# Altium project Smart_Home_v1.PrjPcb
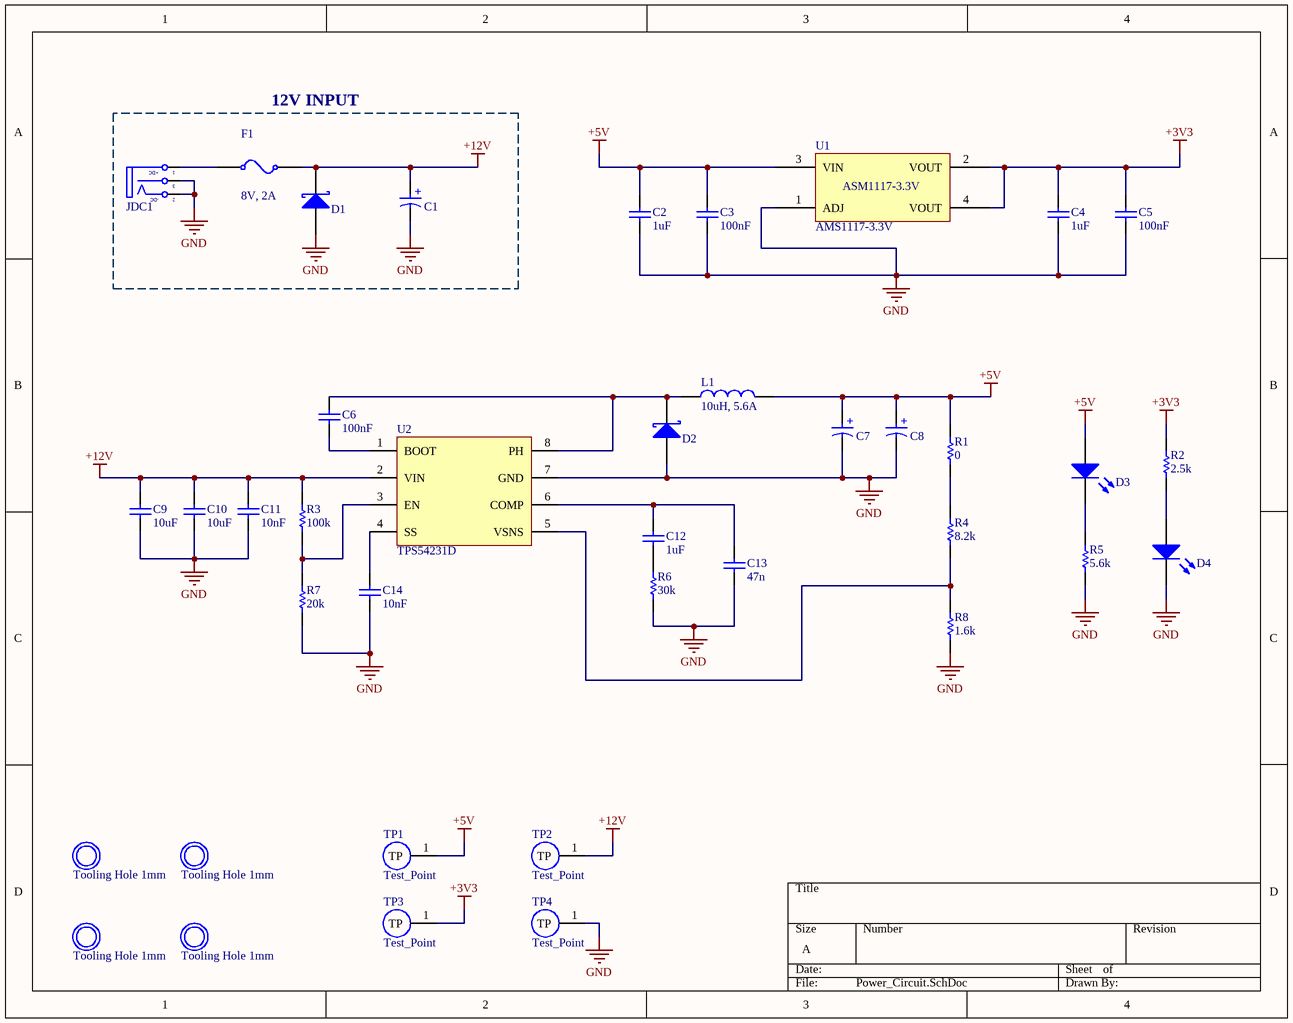
[diagram p0: Power_Circuit.SchDoc]
5 sheets, 133 parts. Net scope: flat (ports and power ports of the same name join across sheets).
Board file: PCB1.PcbDoc
Sheets:
  Power_Circuit.SchDoc
  STM.SchDoc
  ESP.SchDoc
  Output.SchDoc
  Sheet1.SchDoc

## Sheet Power_Circuit.SchDoc
size A; SheetNumber: 1; SheetTotal: 5

### Parts
C1  47uF  [WCAP-ASLI_D4H5.5]  (value not drawn)
C2  1uF  [CAP_0603]
C3  100nF  [CAP_0603]
C4  1uF  [CAP_0603]
C5  100nF  [CAP_0603]
C6  100nF  [CAP_0603]
C7  47uF  [WCAP-ASLI_D5H5.5]  (value not drawn)
C8  47uF  [WCAP-ASLI_D5H5.5]  (value not drawn)
C9  10uF  [CAP_0603]
C10  10uF  [CAP_0603]
C11  10nF  [CAP_0603]
C12  1uF  [CAP_0603]
C13  47n  [CAP_0603]
C14  10nF  [CAP_0603]
D1  D Schottky  [SS34]  (value not drawn)
D2  D Schottky  [SS34]  (value not drawn)
D3  LED SMD  [LED_0805_Blue]  (value not drawn)
D4  LED SMD  [LED_0805_Blue]  (value not drawn)
F1  8V, 2A  [Fuse_SMD_1812]
H1  Tooling Hole 1mm  [2mm]
H2  Tooling Hole 1mm  [2mm]
H3  Tooling Hole 1mm  [2mm]
H4  Tooling Hole 1mm  [2mm]
JDC1  Jack DC  [DC-IN]  (value not drawn)
L1  10uH, 5.6A  [WE-PD2A_5848]
R1  0  [resistor_0603]
R2  2.5k  [resistor_0603]
R3  100k  [resistor_0603]
R4  8.2k  [resistor_0603]
R5  5.6k  [resistor_0603]
R6  30k  [resistor_0603]
R7  20k  [resistor_0603]
R8  1.6k  [resistor_0603]
TP1  Test_Point  [TP_2MM]
TP2  Test_Point  [TP_2MM]
TP3  Test_Point  [TP_2MM]
TP4  Test_Point  [TP_2MM]
U1  AMS1117-3.3V  [AMS1117-3.3V SOT223]
U2  TPS54231D  [SOIC8]

### Blocks framed on the sheet
12V INPUT: C1 D1 F1 JDC1

### Nets
+3V3: C4.2 C5.2 R2.2 TP3.1(TP) U1.2(VOUT) U1.4(VOUT)
+5V: C2.2 C3.2 C7.1(P) C8.1(P) D3.1(A) L1.2 R1.2 TP1.1(TP) U1.3(VIN)
+12V: C1.1(P) C9.2 C10.2 C11.2 D1.2(K) F1.1 R3.2 TP2.1(TP) U2.2(VIN)
GND: C1.2(N) C2.1 C3.1 C4.1 C5.1 C7.2(N) C8.2(N) C9.1 C10.1 C11.1 C13.1 C14.1 D1.1(A) D2.1(A) D4.2(K) JDC1.2(TN) JDC1.3(S) R5.1 R6.1 R7.1 R8.1 TP4.1(TP) U1.1(ADJ) U2.7(GND)
NetC6_1: C6.1 U2.1(BOOT)
NetC6_2: C6.2 D2.2(K) L1.1 U2.8(PH)
NetC12_1: C12.1 C13.2 U2.6(COMP)
NetC12_2: C12.2 R6.2
NetC14_2: C14.2 U2.4(SS)
NetD3_2: D3.2(K) R5.2
NetD4_1: D4.1(A) R2.1
NetF1_0: F1.0 JDC1.1(T)
NetR1_1: R1.1 R4.2
NetR3_1: R3.1 R7.2 U2.3(EN)
NetR4_1: R4.1 R8.2 U2.5(VSNS)

### Notes on the sheet
- (in symbol 865080340003) +
- (in symbol 865080342006) +
- (in symbol AMS1117-3.3V) ASM1117-3.3V
- (in symbol Jack DC) +DC; -DC

### Library data of the parts
C1 = 865080340003: V-Chip, D4 x H5.5mm, 22uF, 16V; Capacitance Tolerance: +/-20%; Dissipation Factor: 16%; Endurance: 2000h; Leakage Current: 3.52uA; Ripple Current: 90mA; Supply 1 Name: Mouser; Supply 1 SN: 710-865080340003; Supply 2 Name: thegioiic; Category: Aluminum Electrolytic Capacitors; ComponentLink2Description: Datasheet Link; ComponentLink2URL: https://www.we-online.com/redexpert/spec/865080340003?ad; Mount: Surface Mount; Operating Temperature Max: 105°C; Operating Temperature Min: -55°C; Packaging: Tape and Reel; Height: 5.5mm; Diameter: 4mm; Capacitance: 22uF; Rated Voltage (DC): 16V; Supply 1 URL: https://www.mouser.com/ProductDetail/Wurth-Elektronik/865080340003?qs=0KOYDY2FL2%252BowmC4S50IuQ%3D%3D; Supply 2 URL: https://www.thegioiic.com/tu-nhom-smd-22uf-16v-4x5-4mm
C2 C4 C12 = 01060310510: CAP, size 0603, 1uF; Supply 1 SN: 885012206126; Supply 1 name: Wurth Elektronik; Supply 2 name: Thegioiic; Capacitance Tolerance: +/-10%; ComponentLink1Description: Manufacturer; ComponentLink1URL: http://www.we-online.de; ComponentLink2Description: Datasheet; ComponentLink2URL: https://www.we-online.com/components/products/datasheet/885012206126.pdf; Operating Temperature: -55 to +125degC; Packaging: Tape and Reel; Supply 1 URL: https://www.we-online.com/en/components/products/WCAP-CSGP-50VDC?sq=885012206126#885012206126; Supply 2 SN: *; Supply 2 URL: https://www.thegioiic.com/tu-gom-0603-1uf-50v; Dissipation Factor: *; Height: *; Mounting Technology: SMT; Size: 0603; Capacitance: 1uF; Technical Reference: *
C3 C5 C6 = 01060310410: CAP, size 0603, 100nF; Supply 1 SN: 885012206095; Supply 1 name: Wurth Elektronik; Supply 2 name: Thegioiic; Capacitance Tolerance: +/-10%; ComponentLink1Description: Manufacturer; ComponentLink1URL: http://www.we-online.de; ComponentLink2Description: Datasheet; ComponentLink2URL: https://www.we-online.com/catalog/datasheet/885012206095.pdf; Operating Temperature: -55 to +125degC; Packaging: Tape and Reel; Supply 1 URL: https://www.we-online.com/en/components/products/WCAP-CSGP-50VDC?sq=885012206095R#885012206095R; Supply 2 SN: *; Supply 2 URL: https://www.thegioiic.com/tu-gom-0603-100nf-0-1uf-50v; Dissipation Factor: *; Height: *; Mounting Technology: SMT; Size: 0603; Capacitance: 100nF; Technical Reference: *
C7 C8 = 865080342006: V-Chip, D5 x H5.5mm, 47uF, 16V; Capacitance Tolerance: +/-20%; Dissipation Factor: 16%; Endurance: 2000h; Leakage Current: 7.52uA; Ripple Current: 195mA; Supply 1 Name: Mouser; Supply 1 SN: 710-865080262015; Supply 2 Name: thegioiic; Category: Aluminum Electrolytic Capacitors; ComponentLink2Description: Datasheet Link; ComponentLink2URL: https://www.we-online.com/redexpert/spec/865080342006?ad; Mount: Surface Mount; Operating Temperature Max: 105°C; Operating Temperature Min: -55°C; Packaging: Tape and Reel; Height: 5.5mm; Diameter: 5mm; Capacitance: 47uF; Rated Voltage (DC): 16V; Supply 1 URL: https://www.mouser.com/ProductDetail/Wurth-Elektronik/865080262015?qs=0KOYDY2FL2%2Ffe5w2MssUoQ%3D%3D; Supply 2 URL: https://www.thegioiic.com/tu-nhom-smd-47uf-16v-5x5-4mm
C9 C10 = 01060310010: CAP, size 0603,10uF; Supply 2 name: Thegioiic; Capacitance Tolerance: +/-10%; ComponentLink1Description: Manufacturer; ComponentLink1URL: *; ComponentLink2Description: Datasheet; ComponentLink2URL: *; Operating Temperature: -55 to +125degC; Packaging: Tape and Reel; Supply 1 SN: *; Supply 1 name: *; Supply 1 URL: *; Supply 2 SN: *; Supply 2 URL: https://www.thegioiic.com/tu-gom-0603-10uf-16v; Dissipation Factor: *; Height: *; Mounting Technology: SMT; Size: 0603; Capacitance: 10uF; Technical Reference: *
C11 C14 = 01060310310: CAP, size 0603, 10nF; Supply 1 SN: 885012206089; Supply 1 name: Wurth Elektronik; Supply 2 name: Thegioiic; Capacitance Tolerance: +/-10%; ComponentLink1Description: Manufacturer; ComponentLink1URL: http://www.we-online.de; ComponentLink2Description: Datasheet; ComponentLink2URL: https://www.we-online.com/catalog/datasheet/885012206089.pdf; Operating Temperature: -55 to +125degC; Packaging: Tape and Reel; Supply 1 URL: https://www.we-online.com/en/components/products/WCAP-CSGP-50VDC?sq=885012206089#885012206089; Supply 2 SN: *; Supply 2 URL: https://www.thegioiic.com/tu-gom-0603-10nf-50v; Dissipation Factor: *; Height: *; Mounting Technology: SMT; Size: 0603; Capacitance: 10nF; Technical Reference: *
C13 = 01060347310: CAP, size 0603, 47nF; Supply 1 SN: 885012206093; Supply 1 name: Wurth Elektronik; Supply 2 name: Thegioiic; Capacitance Tolerance: +/-10%; ComponentLink1Description: Manufacturer; ComponentLink1URL: http://www.we-online.de; ComponentLink2Description: Datasheet; ComponentLink2URL: https://www.we-online.com/catalog/datasheet/885012206093.pdf; Operating Temperature: -55 to +125degC; Packaging: Tape and Reel; Supply 1 URL: https://www.we-online.com/en/components/products/WCAP-CSGP-50VDC?sq=885012206093#885012206093; Supply 2 SN: *; Supply 2 URL: https://www.thegioiic.com/tu-gom-0603-47nf-50v; Dissipation Factor: *; Height: *; Mounting Technology: SMT; Size: 0603; Capacitance: 47nF; Technical Reference: *
D1 D2 = D Schottky: Schottky Diode; Published: 8-Jun-2000; LatestRevisionDate: 17-Jul-2002; LatestRevisionNote: Re-released for DXP Platform.; PackageReference: SMB; Publisher: Altium Limited; PackageDescription: DO-214-AA/SMB; 2 C-Bend Leads; Body 5.3 x 3.6 mm, inc. leads (LxW); Code_JEDEC: DO-214-AA
D3 D4 = LED SMD: LED
F1 = 061812200008: Resettable Fuse, Size 1812, 8V, 2A; Manufacturer: Littelfuse; Threshold Current: 100A; Trip Current: 4A; Supply 1 Name: Mouser; Supply 1 SN: 650-MINISMDC200F-2; Supply 2 Name: Digikey; Supply 2 SN: MINISMDC200F-2TR-ND; Supply 3 Name: Thegioiic; Threshold Voltage: 8V; Hold Current: 2A; Size: 1812; Mounting Technology: SMT/SMD; ComponentLink1Description: Datasheet link; ComponentLink1URL: https://www.littelfuse.com/~/media/electronics/product_specifications/resettable_ptcs/littelfuse_ptc_minismdc300f_2_product_specification.pdf.pdf; ComponentLink2Description: Supply 1 URL; ComponentLink2URL: https://www.mouser.vn/ProductDetail/Littelfuse/MINISMDC200F-2?qs=F6FIpiMdEVbPu4q%2F42CC1w%3D%3D; ComponentLink3Description: Supply 2 URL; ComponentLink3URL: https://www.digikey.com/en/products/detail/littelfuse-inc/MINISMDC200F-2/1045898?s=N4IgTCBcDaIAQFkCSA5JBlBARAwmADPgGIC0EAugL5A; ComponentLink4Description: Supply 3 URL; ComponentLink4URL: https://www.thegioiic.com/cau-chi-tu-phuc-hoi-1812-8v-2a; Supply 3 SN: N/A
H1-H4 = Tooling Hole 2mm
JDC1 = Jack DC: Jack DC input; Value: Jac DC
L1 = 78477410: WE-PD2A SMT Power Inductor, size 5848, 10uH, 2.2A; Manufacturer: Wurth Elektronik; DC Resistance max.: 0.1Ohm; Saturation Current: 2.5A; Self Resonant Frequency: 26MHz; DC Resistance typ.: 0.078Ohm; Rated Voltage: 80VDC; Supply 1 Name: Digi-Key; Supply 1 SN: 732-6830-2-ND; Supply 2 Name: Mouser; Supply 2 SN: 710-78477410; Supply 3 Name: thegioiic; ComponentLink1Description: Manufacturer; ComponentLink1URL: http://www.we-online.de; ComponentLink2Description: Datasheet; ComponentLink2URL: https://www.we-online.com/catalog/datasheet/78477410.pdf; Manufacturer Part Number: 78477410; Published Date: May 2020; Rated Current: 2.2A; Inductance: 10uH; Operating Temperature: -40 to +125degC; Mounting Technology: SMT; Packaging: Tape and Reel; Size: 5848; Supply 1 URL: https://www.digikey.com/en/products/detail/w%C3%BCrth-elektronik/78477410/5168779?s=N4IgTCBcDaIOwA4Asc5IIwAYQF0C%2BQA; Supply 2 URL: https://www.mouser.vn/ProductDetail/Wurth-Elektronik/78477410?qs=sBf%2Fb4nBSldlX6CYaJExDg%3D%3D; Supply 3 URL: https://www.thegioiic.com/cuon-cam-dan-smd-cd53-5852-100-10uh-1-8a
R1 = 0006030001: RES, 0 Ohm, size 0603, 1%; Resistance tolerance: +/-5%; Rated Power: 1/4 W; Resistance: 2.5K; Size: 0603; Mounting Technology: SMT; Datasheet: *; ComponentLink1Description: Datasheet link; ComponentLink1URL: *; Supply 1 Name: *; Supply 1 SN: *; Supply 1 URL: *; Supply 2 Name: *; Supply 2 SN: *; Supply 2 URL: *; Supply 3 Name: *; Supply 3 SN: *; Supply 3 URL: *; Manufacture  Name: *; Manufacture  SN: *
R2 = 0006032525: RES, 2.5K Ohm, size 0603, 5%; Resistance tolerance: +/-5%; Rated Power: 1/4 W; Size: 0603; Mounting Technology: SMT; Datasheet: *; Resistance: 2.5K; ComponentLink1Description: Datasheet link; ComponentLink1URL: *; Supply 1 Name: *; Supply 1 SN: *; Supply 1 URL: *; Supply 2 Name: *; Supply 2 SN: *; Supply 2 URL: *; Supply 3 Name: *; Supply 3 SN: *; Supply 3 URL: *; Manufacture  Name: *; Manufacture  SN: *
R3 = 0006031041: RES, 100k Ohm, size 0603, 1%; Resistance Tolerant: +/-1%; Rated Power: 1/4W; Supply 1 Name: Mouser; Supply 1 SN: 603-SR0603FR-7T100KL; Supply 2 Name: Digikey; Supply 2 SN: YAG5821TR-ND YAG5821CT-ND YAG5821DKR-ND; Resistance: 100k; Size: 0603; Mounting Technology: SMT; ComponentLink1Description: Datasheet link; ComponentLink1URL: https://www.yageo.com/upload/media/product/productsearch/datasheet/rchip/PYu-SR_20105_RoHS_L_10.pdf; ComponentLink2Description: Supply 1 URL; ComponentLink2URL: https://www.mouser.vn/ProductDetail/YAGEO/SR0603FR-7T100KL?qs=sGAEpiMZZMvdGkrng054tz1y1XEHv7sNa%252BA%2F4WiDMf7aGw4zRBb%2FFQ%3D%3D; ComponentLink3Description: Supply 2 URL; ComponentLink3URL: https://www.digikey.com/en/products/detail/yageo/SR0603FR-7T100KL/9373095
R4 = 0006038251: RES, 8.2 kOhms, size 0603, 1%; Resistance tolerance: +/-1%; Rated Power: 1/4 W; Supply 1 Name: Mouser; Supply 1 SN: 660-HV731JTTD8204F; Supply 2 Name: Digi-Key; Supply 2 SN: 13-RC0603FR-078M2LTR-ND; Size: 0603; Mounting Technology: SMT; Resistance: 8.2K; ComponentLink1Description: Datasheet link; ComponentLink1URL: *; Supply 1 URL: https://www.mouser.vn/ProductDetail/KOA-Speer/HV731JTTD8204F?qs=ZqVPfSd1khqN0teaqWW7DA%3D%3D; Supply 2 URL: https://www.digikey.com/en/products/detail/yageo/RC0603FR-078M2L/5918418; Supply 3 Name: *; Supply 3 SN: *
R5 = 0006035621: RES, 5.6k Ohm, size 0603, 1%; Resistance Tolerant: +/-1%; Rated Power: 1/4W; Supply 1 Name: Mouser; Supply 1 SN: 667-ERJ-UP3F5601V; Supply 2 Name: Digikey; Supply 2 SN: 10-ERJ-UP3F5601VTR-ND 10-ERJ-UP3F5601VCT-ND 10-ERJ-UP3F5601VDKR-ND; Resistance: 5.6k; Size: 0603; Mounting Technology: SMT; ComponentLink1Description: Datasheet link; ComponentLink1URL: https://api.pim.na.industrial.panasonic.com/file_stream/main/fileversion/4484; ComponentLink2Description: Supply 1 URL; ComponentLink2URL: https://www.mouser.vn/ProductDetail/Panasonic/ERJ-UP3F5601V?qs=sGAEpiMZZMvdGkrng054twq3eZrCFN89ezYxgAsnxBTZYD17cS%252B65A%3D%3D; ComponentLink3Description: Supply 2 URL; ComponentLink3URL: https://www.digikey.com/en/products/detail/panasonic-electronic-components/ERJ-UP3F5601V/12092890
R6 = 0006033205: RES, 30k Ohm, size 0603, 1%; Resistance tolerance: +/-1%; Rated Power: 1/4 W; Size: 0603; Mounting Technology: SMT; Datasheet: *; Resistance: 30k; ComponentLink1Description: Datasheet link; ComponentLink1URL: *; Supply 1 Name: *; Supply 1 SN: *; Supply 1 URL: *; Supply 2 Name: *; Supply 2 SN: *; Supply 2 URL: *; Supply 3 Name: *; Supply 3 SN: *; Supply 3 URL: *; Manufacture  Name: *; Manufacture  SN: *
R7 = 0006032031: RES, 20 kOhms, size 0603, 1%; Resistance tolerance: +/-1%; Rated Power: 1/4 W; Supply 1 Name: Mouser; Supply 1 SN: 667-ERJ-S03F2002V; Supply 2 Name: Digi-Key; Supply 2 SN: 13-RC0603FR-1320KLTR-ND; Size: 0603; Mounting Technology: SMT; Resistance: 20 k; ComponentLink1Description: Datasheet link; ComponentLink1URL: *; Supply 1 URL: https://www.mouser.vn/ProductDetail/Panasonic/ERJ-S03F2002V?qs=Zyl8A9hlmJopfTdqNIDujw%3D%3D; Supply 2 URL: https://www.digikey.com/en/products/detail/yageo/RC0603FR-1320KL/13694225; Supply 3 Name: *; Supply 3 SN: *
R8 = 0006031521: RES, 1.5 kOhms, size 0603, 1%; Resistance tolerance: +/-1%; Rated Power: 1/4 W; Resistance: 1.5 k; Supply 1 Name: Mouser; Supply 1 SN: 755-SFR03EZPF1501; Supply 2 Name: Digi-Key; Supply 2 SN: 13-RC0603FR-071R5LTR-ND; Size: 0603; Mounting Technology: SMT; ComponentLink1Description: Datasheet link; ComponentLink1URL: *; Supply 1 URL: https://www.mouser.vn/ProductDetail/ROHM-Semiconductor/SFR03EZPF1501?qs=byeeYqUIh0NryWvnzlukLQ%3D%3D; Supply 2 URL: https://www.digikey.com/en/products/detail/yageo/RC0603FR-071R5L/5918292; Supply 3 Name: *; Supply 3 SN: *
TP1-TP4 = Test_Point: Test point, 2mm radius
U1 = AMS1117-3.3V: AMS1117-3.3V, OUT 3.3V 1A.; Manufacturer: AMS; Pad Count: 4; Current Output Maximum: 1A; Voltage Input Maximum: 15V; Manufacturer Part Number: *; Part Number: *; Current Input Maximum: *; Supplier 1 Link: *; Supplier 1 Name: *; Supplier 2 Link: *; Supplier 2 Name: *; Supplier 2 Part Number: *; Supplier 3 Link: https://www.thegioiic.com/ams1117-3-3v-ic-on-ap-3-3v-1a-sot-223; Supplier 3 Name: ThegioiIC; Supplier 3 Part Number: *; Voltage Output: 3.3V; Mounting Technology: SMD; Supplier 1 Part Number: *; Datasheet: http://www.advanced-monolithic.com/pdf/ds1117.pdf
U2 = TPS54231: Buck Switching Regulator IC Positive Adjustable 0.8V 1 Output 2A 8-SOIC (0.154", 3.90mm Width); Mfr: Texas Instruments; Function: Step-Down; Number of Outputs: 1; Voltage - Input (Min): 3.5V; Voltage - Input (Max): 28V; Voltage - Output (Max): 25V; Frequency - Switching: 570kHz; Category: Integrated Circuits (ICs); Output Configuration: Positive; Topology: Buck; Output Type: Adjustable; Voltage - Output (Min/Fixed): 0.8V; Current - Output: 2A; Operating Temperature: -40°C ~ 150°C (TJ); Mounting Type: Surface Mount; ComponentLink1Description: Thegioiic; ComponentLink1URL: https://www.thegioiic.com/tps54231dr-ic-dieu-chinh-giam-ap-2a-8-soic; ComponentLink2Description: Datasheet; ComponentLink2URL: https://www.ti.com/lit/ds/symlink/tps54231.pdf

## Sheet STM.SchDoc
size A; SheetNumber: 2; SheetTotal: 5
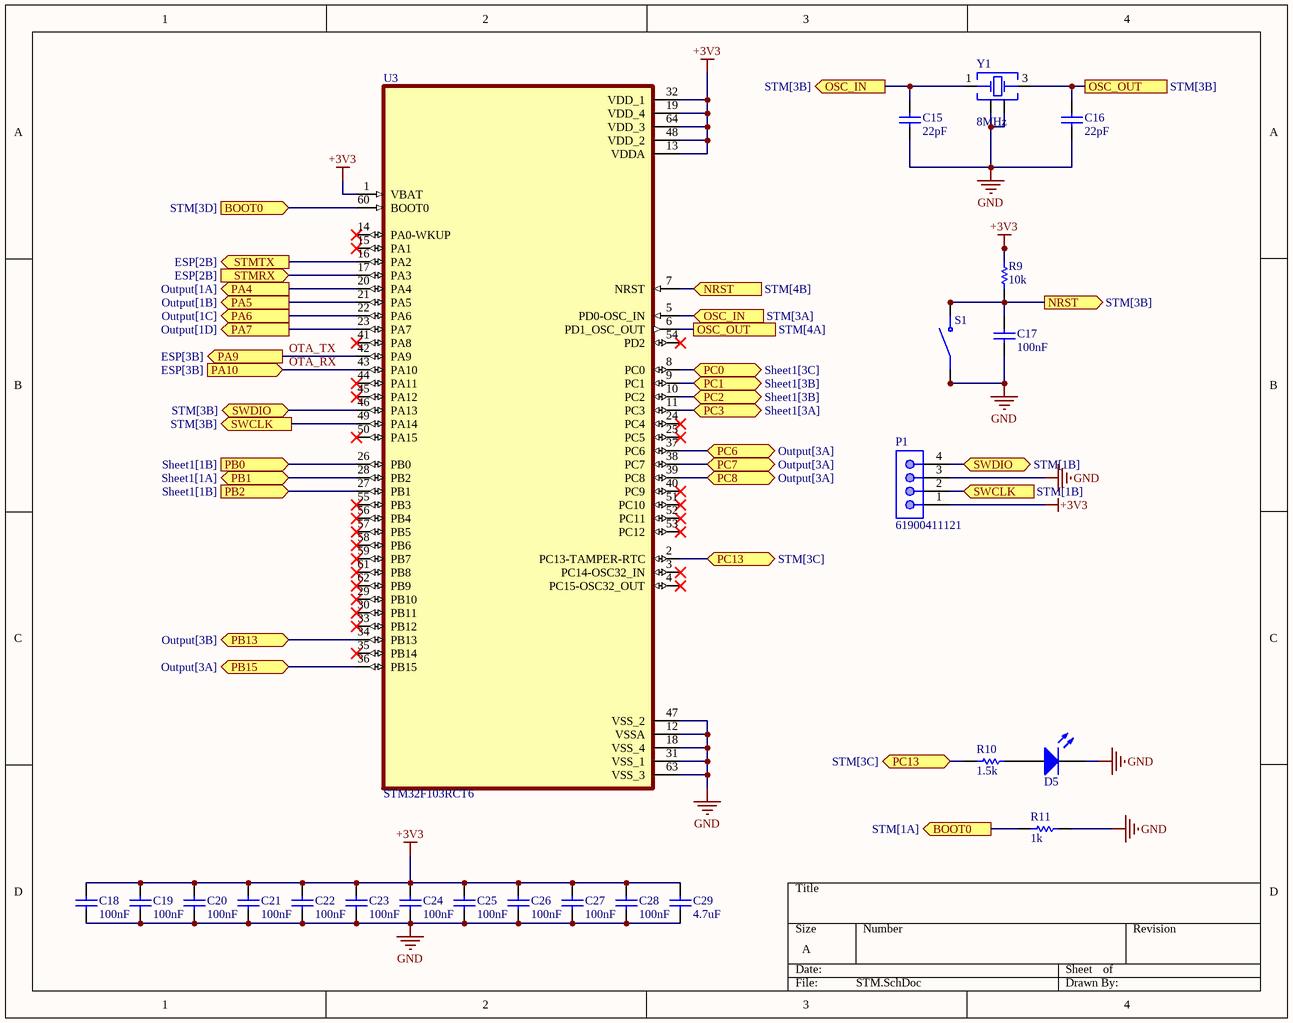
[diagram p1: STM.SchDoc]

### Parts
C15  22pF  [CAP_0603]
C16  22pF  [CAP_0603]
C17  100nF  [CAP_0603]
C18  100nF  [CAP_0603]
C19  100nF  [CAP_0603]
C20  100nF  [CAP_0603]
C21  100nF  [CAP_0603]
C22  100nF  [CAP_0603]
C23  100nF  [CAP_0603]
C24  100nF  [CAP_0603]
C25  100nF  [CAP_0603]
C26  100nF  [CAP_0603]
C27  100nF  [CAP_0603]
C28  100nF  [CAP_0603]
C29  4.7uF  [CAP_0603]
D5  LED SMD  [LED_0805_Blue]  (value not drawn)
P1  61900411121  [61900411121]
R9  10k  [resistor_0603]
R10  1.5k  [resistor_0603]
R11  1k  [resistor_0603]
S1  (no value)  [SW_8-1437565-1]
U3  STM32F103RCT6  [QFP50P1200X1200X160-64N]
Y1  8MHz  [WE-XTAL_CFPX-104]

### Ports
BOOT0 (in, see STM[3D]), BOOT0 (out, see STM[1A]), NRST (in, see STM[4B]), NRST (out, see STM[3B]), OSC_IN (in, see STM[3A]), OSC_IN (out, see STM[3B]), OSC_OUT (see STM[3B]), OSC_OUT (see STM[4A]), PA4 (out, see Output[1A]), PA5 (out, see Output[1B]), PA6 (out, see Output[1C]), PA7 (out, see Output[1D]), PA9 (out, see ESP[3B]), PA10 (in, see ESP[3B]), PB0 (in, see Sheet1[1B]), PB1 (bidir, see Sheet1[1A]), PB2 (in, see Sheet1[1B]), PB13 (bidir, see Output[3B]), PB15 (bidir, see Output[3A]), PC0 (bidir, see Sheet1[3C]), PC1 (bidir, see Sheet1[3B]), PC2 (bidir, see Sheet1[3B]), PC3 (bidir, see Sheet1[3A]), PC6 (bidir, see Output[3A]), PC7 (bidir, see Output[3A]), PC8 (bidir, see Output[3A]), PC13 (bidir, see STM[3C]), STMRX (in, see ESP[2B]), STMTX (out, see ESP[2B]), SWCLK (in, see STM[1B]), SWCLK (out, see STM[3B]), SWDIO (bidir, see STM[1B]), SWDIO (bidir, see STM[3B])

### Nets
+3V3: C18.2 C19.2 C20.2 C21.2 C22.2 C23.1 C24.2 C25.2 C26.2 C27.2 C28.2 C29.2 P1.1 R9.2 U3.1(VBAT) U3.13(VDDA) U3.19(VDD_4) U3.32(VDD_1) U3.48(VDD_2) U3.64(VDD_3)
GND: C15.1 C16.1 C17.1 C18.1 C19.1 C20.1 C21.1 C22.1 C23.2 C24.1 C25.1 C26.1 C27.1 C28.1 C29.1 D5.2(K) P1.3 R11.2 S1.1(COM) S1.2(COM) U3.12(VSSA) U3.18(VSS_4) U3.31(VSS_1) U3.47(VSS_2) U3.63(VSS_3) Y1.2(GND) Y1.4(GND)
OTA_RX: U3.43(PA10) ; port PA10
OTA_TX: U3.42(PA9) ; port PA9
NetC15_2: C15.2 U3.5(PD0-OSC_IN) Y1.1(OSC1) ; port OSC_IN
NetC16_2: C16.2 U3.6(PD1_OSC_OUT) Y1.3(OSC2) ; port OSC_OUT
NetC17_2: C17.2 R9.1 S1.3(NO) S1.4(NO) U3.7(NRST) ; port NRST
NetC39_1: U3.11(PC3) ; port PC3
NetC40_1: U3.10(PC2) ; port PC2
NetC41_1: U3.9(PC1) ; port PC1
NetC42_1: U3.8(PC0) ; port PC0
NetD5_1: D5.1(A) R10.1
NetJ2_3: U3.39(PC8) ; port PC8
NetJ2_4: U3.38(PC7) ; port PC7
NetJ2_5: U3.37(PC6) ; port PC6
NetJ2_6: U3.36(PB15) ; port PB15
NetJ2_7: U3.34(PB13) ; port PB13
NetJ3_2: U3.28(PB2) ; port PB1
NetJ4_2: U3.27(PB1) ; port PB2
NetP1_2: P1.2 U3.49(PA14) ; port SWCLK
NetP1_4: P1.4 U3.46(PA13) ; port SWDIO
NetR10_2: R10.2 U3.2(PC13-TAMPER-RTC) ; port PC13
NetR11_1: R11.1 U3.60(BOOT0) ; port BOOT0
NetU3_16: U3.16(PA2) ; port STMTX
NetU3_17: U3.17(PA3) ; port STMRX
NetU3_20: U3.20(PA4) ; port PA4
NetU3_21: U3.21(PA5) ; port PA5
NetU3_22: U3.22(PA6) ; port PA6
NetU3_23: U3.23(PA7) ; port PA7
NetU3_26: U3.26(PB0) ; port PB0

Not connected (* = marked no-connect by the designer): U3 3(PC14-OSC32_IN)* 4(PC15-OSC32_OUT)* 14(PA0-WKUP)* 15(PA1)* 24(PC4)* 25(PC5)* 29(PB10)* 30(PB11)* 33(PB12)* 35(PB14)* 40(PC9)* 41(PA8)* 44(PA11)* 45(PA12)* 50(PA15)* 51(PC10)* 52(PC11)* 53(PC12)* 54(PD2)* 55(PB3)* 56(PB4)* 57(PB5)* 58(PB6)* 59(PB7)* 61(PB8)* 62(PB9)*

### Library data of the parts
C15 C16 = 01060322010: CAP, size 0603, 22pF; Supply 2 name: Thegioiic; Capacitance Tolerance: +/-10%; ComponentLink1Description: Manufacturer; ComponentLink1URL: Thegioiic; ComponentLink2Description: Datasheet; ComponentLink2URL: *; Operating Temperature: -55 to +125degC; Packaging: Tape and Reel; Supply 1 SN: *; Supply 1 name: *; Supply 1 URL: *; Supply 2 SN: *; Supply 2 URL: https://www.thegioiic.com/tu-gom-0603-22pf-50v; *: *; Height: *; Mounting Technology: SMT; Size: 0603; Capacitance: 22pF; Technical Reference: *
C17-C28 = 01060310410: as C3 on sheet Power_Circuit; ComponentLink1Description: Manufacturer; ComponentLink1URL: http://www.we-online.de; ComponentLink2Description: Datasheet; ComponentLink2URL: https://www.we-online.com/catalog/datasheet/885012206095.pdf; Operating Temperature: -55 to +125degC; Packaging: Tape and Reel; Supply 1 URL: https://www.we-online.com/en/components/products/WCAP-CSGP-50VDC?sq=885012206095R#885012206095R; Supply 2 SN: *; Supply 2 URL: https://www.thegioiic.com/tu-gom-0603-100nf-0-1uf-50v; Dissipation Factor: *; Height: *; Mounting Technology: SMT; Size: 0603; Capacitance: 100nF; Technical Reference: *
C29 = 01060310510: as C2 on sheet Power_Circuit; ComponentLink1Description: Manufacturer; ComponentLink1URL: http://www.we-online.de; ComponentLink2Description: Datasheet; ComponentLink2URL: https://www.we-online.com/components/products/datasheet/885012206126.pdf; Operating Temperature: -55 to +125degC; Packaging: Tape and Reel; Supply 1 URL: https://www.we-online.com/en/components/products/WCAP-CSGP-50VDC?sq=885012206126#885012206126; Supply 2 SN: *; Supply 2 URL: https://www.thegioiic.com/tu-gom-0603-1uf-50v; Dissipation Factor: *; Height: *; Mounting Technology: SMT; Size: 0603; Capacitance: 1uF; Technical Reference: *
D5 = LED SMD: LED
P1 = 61900411121: WR-WTB THT Male Vertical Locking Header, pitch 2.54mm, 4p; Pin Number: 4; Contact Resistance: 20mOhm; Rated Current: 3A; Withstanding Voltage: 1000VAC; Working Voltage: 250VAC; ComponentLink1Description: Manufacturer; ComponentLink1URL: http://www.we-online.de; ComponentLink2Description: Datasheet; ComponentLink2URL: https://www.we-online.com/catalog/datasheet/61900411121.pdf; Pitch: 2.54mm; Published Date: January 2020; Publisher: Wurth Elektronik; Mounting Technology: THT; Packaging: Bag; Operating Temperature: -40 to +105degC; Part Number: 61900411121; Gender: Male; Type: Vertical
R9 R11 = 0006031031: RES, 10k Ohm, size 0603, 1%; Resistance Tolerant: +/-1%; Rated Power: 1/4W; Supply 1 Name: Mouser; Supply 1 SN: 755-ESR03EZPF1002; Supply 2 Name: Digikey; Supply 2 SN: RHM10KADTR-ND RHM10KADCT-ND RHM10KADDKR-ND; Resistance: 10k; Size: 0603; Mounting Technology: SMT; ComponentLink1Description: Datasheet link; ComponentLink1URL: https://fscdn.rohm.com/en/products/databook/datasheet/passive/resistor/chip_resistor/esr-e.pdf; ComponentLink2Description: Supply 1 URL; ComponentLink2URL: https://www.mouser.vn/ProductDetail/ROHM-Semiconductor/ESR03EZPF1002?qs=sGAEpiMZZMvdGkrng054t67Efho1F8r6CDeAsqwFse8%3D; ComponentLink3Description: Supply 2 URL; ComponentLink3URL: https://www.digikey.com/en/products/detail/rohm-semiconductor/ESR03EZPF1002/1983429
R10 = 0006031521: RES, 1.5 kOhms, size 0603, 1%; Resistance tolerance: +/-1%; Rated Power: 1/4 W; Supply 1 Name: Mouser; Supply 1 SN: 755-SFR03EZPF1501; Supply 2 Name: Digi-Key; Supply 2 SN: 13-RC0603FR-071R5LTR-ND; Size: 0603; Mounting Technology: SMT; Resistance: 1.5 k; ComponentLink1Description: Datasheet link; ComponentLink1URL: *; Supply 1 URL: https://www.mouser.vn/ProductDetail/ROHM-Semiconductor/SFR03EZPF1501?qs=byeeYqUIh0NryWvnzlukLQ%3D%3D; Supply 2 URL: https://www.digikey.com/en/products/detail/yageo/RC0603FR-071R5L/5918292; Supply 3 Name: *; Supply 3 SN: *
S1 = 8-1437565-1: Package: None; MP: 8-1437565-1; Price: None; Availability: Unavailable; Value: *
U3 = STM32F103RCT6: ARMÂ® CortexÂ®-M3 STM32F1 Microcontroller IC 32-Bit 72MHz 256KB (256K x 8) FLASH 64-LQFP (10x10); MF: STMicroelectronics; Value: *; SnapEDA_Link: https://www.snapeda.com/parts/STM32F103RCT6/STMicroelectronics/view-part/?ref=snap; MP: STM32F103RCT6; Purchase-URL: https://pricing.snapeda.com/search/part/STM32F103RCT6/?ref=eda; Check_prices: https://www.snapeda.com/parts/STM32F103RCT6/STMicroelectronics/view-part/?ref=eda; Availability: In Stock; Price: None; Package: LQFP-64 STMicroelectronics
Y1 = 830106162701: WE-XTAL Quartz Crystal, SMT, CFPX-104, 8MHz, +/-20ppm; Manufacturer: Wurth Elektronik; Frequency Stability: +/-30ppm; Load Capacitance: 16pF; ComponentLink1Description: Manufacturer; ComponentLink1URL: http://www.we-online.de; ComponentLink2Description: Datasheet; ComponentLink2URL: https://www.we-online.com/catalog/datasheet/830106162701.pdf; Operating Temperature: -40 to +85degC; Packaging: Tape and Reel; Manufacturer Part Number: 830106162701; Published Date: November 2020; Size: CFPX-104; Frequency: 8MHz; Frequency Tolerance: +/-20ppm; Mounting Technology: SMT

## Sheet ESP.SchDoc
size A; SheetNumber: 3; SheetTotal: 5
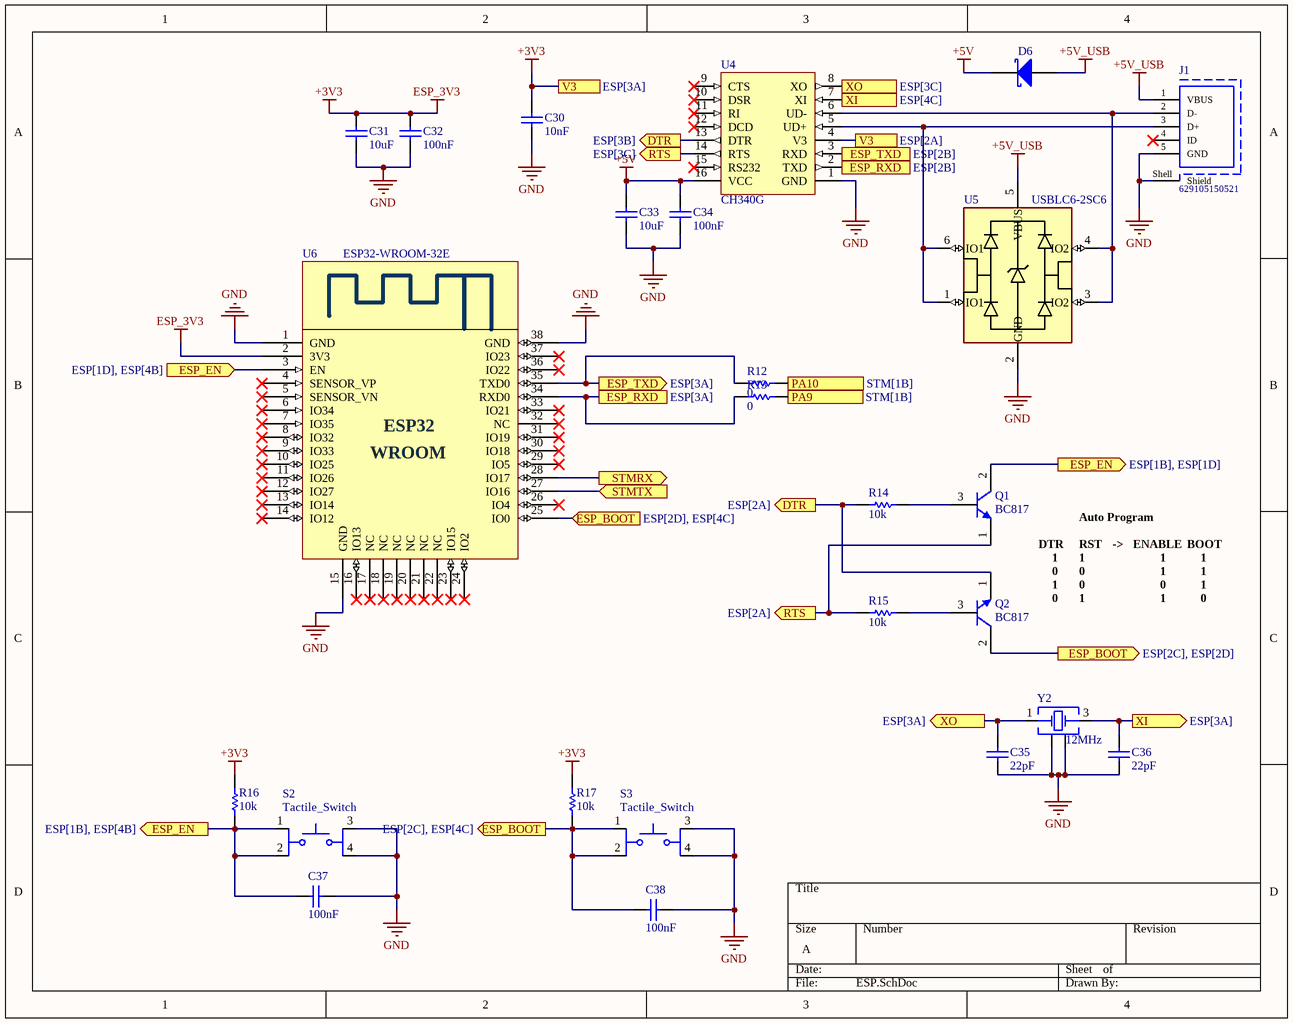
[diagram p2: ESP.SchDoc]

### Parts
C30  10nF  [CAP_0603]
C31  10uF  [CAP_0603]
C32  100nF  [CAP_0603]
C33  10uF  [CAP_0603]
C34  100nF  [CAP_0603]
C35  22pF  [CAP_0603]
C36  22pF  [CAP_0603]
C37  100nF  [CAP_0603]
C38  100nF  [CAP_0603]
D6  D Schottky  [SS34]  (value not drawn)
J1  629105150521  [629105150521]
Q1  BC817  [SOT23B]
Q2  BC817  [SOT23B]
R12  0  [resistor_0603]
R13  0  [resistor_0603]
R14  10k  [resistor_0603]
R15  10k  [resistor_0603]
R16  10k  [resistor_0603]
R17  10k  [resistor_0603]
S2  Tactile_Switch  [Tactile_Button_3x4x2.5]
S3  Tactile_Switch  [Tactile_Button_3x4x2.5]
U4  CH340G  [DSIP-16]
U5  USBLC6-2SC6  [SOT95P280X145-6N]
U6  ESP32-WROOM-32E  [ESP32-WROOM]
Y2  12MHz  [WE-XTAL_CFPX-104]

### Ports
DTR (out, see ESP[2A]), DTR (out, see ESP[3B]), ESP_BOOT (in, see ESP[2D], ESP[4C]), ESP_BOOT (out, see ESP[2C], ESP[2D]), ESP_BOOT (out, see ESP[2C], ESP[4C]), ESP_EN (in, see ESP[1D], ESP[4B]), ESP_EN (out, see ESP[1B], ESP[1D]), ESP_EN (out, see ESP[1B], ESP[4B]), ESP_RXD (see ESP[2B]), ESP_RXD (see ESP[3A]), ESP_TXD (out, see ESP[3A]), ESP_TXD (see ESP[2B]), PA9 (in, see STM[1B]), PA10 (out, see STM[1B]), RTS (out, see ESP[2A]), RTS (out, see ESP[3C]), STMRX (out), STMTX (in), V3 (see ESP[2A]), V3 (see ESP[3A]), XI (in, see ESP[4C]), XI (out, see ESP[3A]), XO (out, see ESP[3A]), XO (out, see ESP[3C])

### Nets
+3V3: C30.1 C31.1 C32.1 R16.1 R17.1 U4.4(V3) U6.2(3V3) ; port V3  [also labelled ESP_3V3]
+5V: C33.2 C34.2 D6.2(K) U4.16(VCC)
+5V_USB: D6.1(A) J1.1(VBUS) U5.5(VBUS)
GND: C30.2 C31.2 C32.2 C33.1 C34.1 C35.1 C36.1 C37.2 C38.2 J1.5(GND) J1.Shell(Shield) S2.3 S2.4 S3.3 S3.4 U4.1(GND) U5.2(GND) U6.1(GND) U6.15(GND) U6.38(GND) Y2.2(GND_&_Lid) Y2.4(GND_&_Lid)
OTA_RX: R12.2 ; port PA10
OTA_TX: R13.2 ; port PA9
NetC35_2: C35.2 U4.8(XO) Y2.1(Crystal) ; port XO
NetC36_2: C36.2 U4.7(XI) Y2.3(Crystal) ; port XI
NetC37_1: C37.1 Q1.2(C) R16.2 S2.1 S2.2 U6.3(EN) ; port ESP_EN
NetC38_1: C38.1 Q2.2(C) R17.2 S3.1 S3.2 U6.25(IO0) ; port ESP_BOOT
NetJ1_2: J1.2(D-) U4.6(UD-) U5.3(IO2) U5.4(IO2)
NetJ1_3: J1.3(D+) U4.5(UD+) U5.1(IO1) U5.6(IO1)
NetQ1_1: Q1.1(E) R15.1 U4.14(RTS) ; port RTS
NetQ1_3: Q1.3(B) R14.2
NetQ2_1: Q2.1(E) R14.1 U4.13(DTR) ; port DTR
NetQ2_3: Q2.3(B) R15.2
NetR12_1: R12.1 U4.3(RXD) U6.35(TXD0) ; port ESP_TXD
NetR13_1: R13.1 U4.2(TXD) U6.34(RXD0) ; port ESP_RXD
NetU3_16: U6.27(IO16) ; port STMTX
NetU3_17: U6.28(IO17) ; port STMRX

Not connected (* = marked no-connect by the designer): J1 4(ID)*; U4 9(CTS)* 10(DSR)* 11(RI)* 12(DCD)* 15(RS232)*; U6 4(SENSOR_VP)* 5(SENSOR_VN)* 6(IO34)* 7(IO35)* 8(IO32)* 9(IO33)* 10(IO25)* 11(IO26)* 12(IO27)* 13(IO14)* 14(IO12)* 16(IO13)* 17(NC)* 18(NC)* 19(NC)* 20(NC)* 21(NC)* 22(NC)* 23(IO15)* 24(IO2)* 26(IO4)* 29(IO5)* 30(IO18)* 31(IO19)* 32(NC)* 33(IO21)* 36(IO22)* 37(IO23)*

### Notes on the sheet
- DTR
- 1
- Auto Program
- RST
- ->
- ENABLE
- BOOT
- 0
- (in symbol ESP32-WROOM) WROOM

### Library data of the parts
C30 = 01060310310: as C11 on sheet Power_Circuit; ComponentLink1Description: Manufacturer; ComponentLink1URL: http://www.we-online.de; ComponentLink2Description: Datasheet; ComponentLink2URL: https://www.we-online.com/catalog/datasheet/885012206089.pdf; Operating Temperature: -55 to +125degC; Packaging: Tape and Reel; Supply 1 URL: https://www.we-online.com/en/components/products/WCAP-CSGP-50VDC?sq=885012206089#885012206089; Supply 2 SN: *; Supply 2 URL: https://www.thegioiic.com/tu-gom-0603-10nf-50v; Dissipation Factor: *; Height: *; Mounting Technology: SMT; Size: 0603; Capacitance: 10nF; Technical Reference: *
C31 C33 = 01060310010: as C9 on sheet Power_Circuit; ComponentLink1Description: Manufacturer; ComponentLink1URL: *; ComponentLink2Description: Datasheet; ComponentLink2URL: *; Operating Temperature: -55 to +125degC; Packaging: Tape and Reel; Supply 1 SN: *; Supply 1 name: *; Supply 1 URL: *; Supply 2 SN: *; Supply 2 URL: https://www.thegioiic.com/tu-gom-0603-10uf-16v; Dissipation Factor: *; Height: *; Mounting Technology: SMT; Size: 0603; Capacitance: 10uF; Technical Reference: *
C32 C34 C37 C38 = 01060310410: as C3 on sheet Power_Circuit; ComponentLink1Description: Manufacturer; ComponentLink1URL: http://www.we-online.de; ComponentLink2Description: Datasheet; ComponentLink2URL: https://www.we-online.com/catalog/datasheet/885012206095.pdf; Operating Temperature: -55 to +125degC; Packaging: Tape and Reel; Supply 1 URL: https://www.we-online.com/en/components/products/WCAP-CSGP-50VDC?sq=885012206095R#885012206095R; Supply 2 SN: *; Supply 2 URL: https://www.thegioiic.com/tu-gom-0603-100nf-0-1uf-50v; Dissipation Factor: *; Height: *; Mounting Technology: SMT; Size: 0603; Capacitance: 100nF; Technical Reference: *
C35 C36 = 01060322010: as C15 on sheet STM; ComponentLink1Description: Manufacturer; ComponentLink1URL: Thegioiic; ComponentLink2Description: Datasheet; ComponentLink2URL: *; Operating Temperature: -55 to +125degC; Packaging: Tape and Reel; Supply 1 SN: *; Supply 1 name: *; Supply 1 URL: *; Supply 2 SN: *; Supply 2 URL: https://www.thegioiic.com/tu-gom-0603-22pf-50v; *: *; Height: *; Mounting Technology: SMT; Size: 0603; Capacitance: 22pF; Technical Reference: *
D6 = D Schottky: Schottky Diode; Published: 8-Jun-2000; LatestRevisionDate: 17-Jul-2002; LatestRevisionNote: Re-released for DXP Platform.; PackageReference: SMB; Publisher: Altium Limited; PackageDescription: DO-214-AA/SMB; 2 C-Bend Leads; Body 5.3 x 3.6 mm, inc. leads (LxW); Code_JEDEC: DO-214-AA
J1 = 629105150521: Micro USB 2.0 Type B Receptacle WR-COM, Horizontal, SMT, with Pegs, High Current at Pin 1 & Pin 5; Rated Current: 3 A; Contact Resistance: 30 mOhm; Working Voltage: 30 VAC; ComponentLink1Description: Manufacturer; ComponentLink1URL: http://www.we-online.de; ComponentLink2Description: Datasheet; ComponentLink2URL: https://katalog.we-online.de/em/datasheet/629105150521.pdf; Part Number: 629105150521; Published Date: September 2018; Publisher: Wurth Elektronik; Orientation: Horizontal; Connector Type: Micro USB 2.0 Type B; Operating Temperature: -40 to 85 degC; Mounting Technology: SMT; Gender: Receptacle; Packaging: Tape and Reel
Q1 Q2 = BC817: NPN Bipolar Transistor
R12 R13 = 0006030001: as R1 on sheet Power_Circuit; Size: 0603; Mounting Technology: SMT; Datasheet: *; ComponentLink1Description: Datasheet link; ComponentLink1URL: *; Supply 1 Name: *; Supply 1 SN: *; Supply 1 URL: *; Supply 2 Name: *; Supply 2 SN: *; Supply 2 URL: *; Supply 3 Name: *; Supply 3 SN: *; Supply 3 URL: *; Manufacture  Name: *; Manufacture  SN: *
R14-R17 = 0006031031: as R9 on sheet STM; Resistance: 10k; Size: 0603; Mounting Technology: SMT; ComponentLink1Description: Datasheet link; ComponentLink1URL: https://fscdn.rohm.com/en/products/databook/datasheet/passive/resistor/chip_resistor/esr-e.pdf; ComponentLink2Description: Supply 1 URL; ComponentLink2URL: https://www.mouser.vn/ProductDetail/ROHM-Semiconductor/ESR03EZPF1002?qs=sGAEpiMZZMvdGkrng054t67Efho1F8r6CDeAsqwFse8%3D; ComponentLink3Description: Supply 2 URL; ComponentLink3URL: https://www.digikey.com/en/products/detail/rohm-semiconductor/ESR03EZPF1002/1983429
S2 S3 = Tactile_Switch: Tactile Switch, 3x4x2.5mm; MP: TL6700AF160QG; Supplier 1 URL: https://www.thegioiic.com/nut-nhan-3x4mm-cao-2-5mm-4-chan-smd; Package: None; Price: None; Availability: Unavailable; ComponentLink1Description: New link; ComponentLink1URL: *; Supplier 1 Name: Thegioiic
U4 = CH340: USB Bridge, USB to UART USB 2.0 UART Interface; Mfr: SparkFun Electronics; Standards: USB 2.0; Voltage - Supply: 3V ~ 3.6V; Current - Supply: 20mA; Protocol: USB; Function: Bridge, USB to UART; Interface: UART; Operating Temperature: -20°C ~ 70°C (TA); ComponentLink1Description: Thegioiic; ComponentLink1URL: https://www.thegioiic.com/ch340g; ComponentLink2Description: Datasheet; ComponentLink2URL: https://www.thegioiic.com/upload/documents/5d39d5f0043101a4c964078db79fe1bd.PDF
U5 = USBLC6-2SC6: 17V Clamp 5A (8/20Âµs) Ipp Tvs Diode Surface Mount SOT-23-6
U6 = ESP32-WROOM: Bluetooth, WiFi 802.11b/g/n, Bluetooth v4.2 +EDR, Class 1, 2 and 3 Transceiver Module 2.4GHz ~ 2.5GHz Integrated, Trace Surface Mount; Mfr: Espressif Systems; Utilized IC / Part: ESP32-D0WD-V3; Modulation: CCK, DSSS, OFDM; Data Rate: 150Mbps; Power - Output: 20dBm; Sensitivity: -98dBm; Serial Interfaces: ADC, GPIO, I²C, I²S, PWM, SDIO, SPI, UART; Memory Size: 4MB Flash, 448kB ROM, 536kB SRAM; Voltage - Supply: 3V ~ 3.6V; Category: RF and Wireless; Series: ESP32; RF Family/Standard: Bluetooth, WiFi; Protocol: 802.11b/g/n, Bluetooth v4.2 +EDR, Class 1, 2 and 3; Frequency: 2.4GHz ~ 2.5GHz; Antenna Type: Integrated, Trace; Mounting Type: Surface Mount; ComponentLink1Description: Hshop; ComponentLink1URL: https://hshop.vn/products/mach-thu-phat-wifi-ble-soc-esp32-v1; Operating Temperature: -40°C ~ 85°C; ComponentLink2Description: Datasheet; ComponentLink2URL: https://www.espressif.com/sites/default/files/russianDocumentation/esp32-wroom-32e_esp32-wroom-32ue_datasheet_en.pdf
Y2 = 830055999: WE-XTAL Quartz Crystal, SMT, CFPX-104, 12MHz, +/-30ppm; Manufacturer: Wurth Elektronik; Load Capacitance: 18pF; ComponentLink1Description: Manufacturer; ComponentLink1URL: http://www.we-online.de; ComponentLink2Description: Datasheet; ComponentLink2URL: https://katalog.we-online.com/pbs/datasheet/830055999.pdf; Operating Temperature: -40 to +85degC; Packaging: Tape and Reel; Manufacturer Part Number: 830055999; Published Date: July 2020; Size: CFPX-104; Frequency Stability: +/-30ppm; Frequency: 12MHz; Frequency Tolerance: +/-30ppm; Mounting Technology: SMT

## Sheet Output.SchDoc
size A; SheetNumber: 4; SheetTotal: 5
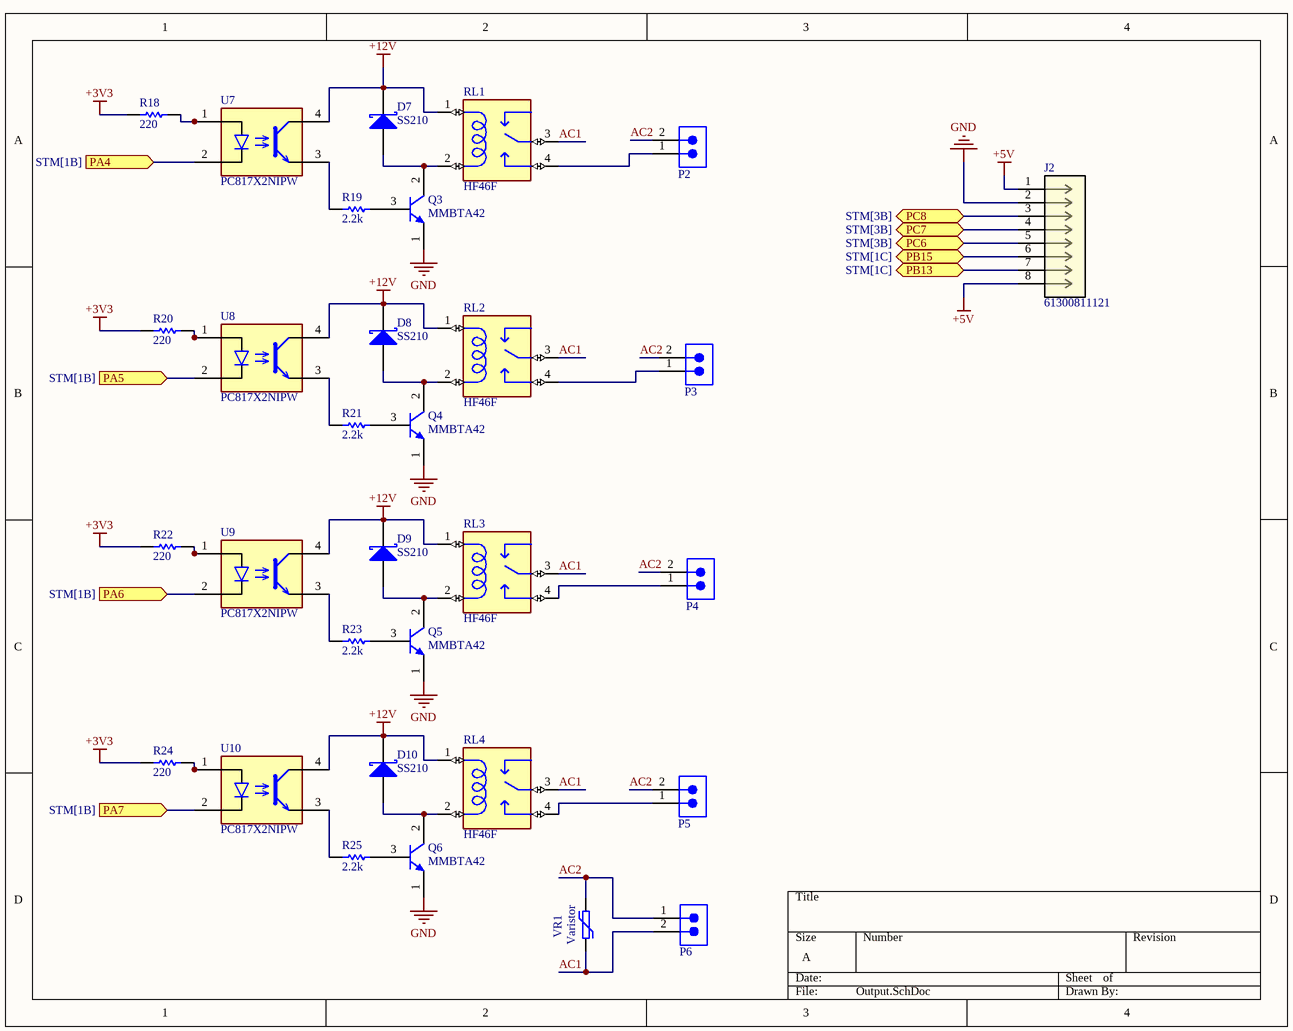
[diagram p3: Output.SchDoc]

### Parts
D7  SS210  [SS34]
D8  SS210  [SS34]
D9  SS210  [SS34]
D10  SS210  [SS34]
J2  61300811121  [CONN8_61300811121_WRE]
P2  691322310002  [691322310002]  (value not drawn)
P3  691322310002  [691322310002]  (value not drawn)
P4  691322310002  [691322310002]  (value not drawn)
P5  691322310002  [691322310002]  (value not drawn)
P6  691322310002  [691322310002]  (value not drawn)
Q3  MMBTA42  [SOT23B]
Q4  MMBTA42  [SOT23B]
Q5  MMBTA42  [SOT23B]
Q6  MMBTA42  [SOT23B]
R18  220  [resistor_0603]
R19  2.2k  [resistor_0603]
R20  220  [resistor_0603]
R21  2.2k  [resistor_0603]
R22  220  [resistor_0603]
R23  2.2k  [resistor_0603]
R24  220  [resistor_0603]
R25  2.2k  [resistor_0603]
RL1  HF46F  [HF46F]
RL2  HF46F  [HF46F]
RL3  HF46F  [HF46F]
RL4  HF46F  [HF46F]
U7  PC817X2NIPW  [PC817XI_SHP]
U8  PC817X2NIPW  [PC817XI_SHP]
U9  PC817X2NIPW  [PC817XI_SHP]
U10  PC817X2NIPW  [PC817XI_SHP]
VR1  Varistor  [07D471K]

### Ports
PA4 (in, see STM[1B]), PA5 (in, see STM[1B]), PA6 (in, see STM[1B]), PA7 (in, see STM[1B]), PB13 (bidir, see STM[1C]), PB15 (bidir, see STM[1C]), PC6 (bidir, see STM[3B]), PC7 (bidir, see STM[3B]), PC8 (bidir, see STM[3B])

### Nets
+3V3: R18.1 R20.1 R22.1 R24.1
+5V: J2.1 J2.8
+12V: D7.2(K) D8.2(K) D9.2(K) D10.2(K) RL1.1(C1) RL2.1(C1) RL3.1(C1) RL4.1(C1) U7.4 U8.4 U9.4 U10.4
GND: J2.2 Q3.1(E) Q4.1(E) Q5.1(E) Q6.1(E)
AC1: P6.2 RL1.3(C) RL2.3(C) RL3.3(C) RL4.3(C) VR1.2
AC2: P2.2 P3.2 P4.2 P5.2 P6.1 VR1.1
NetD7_1: D7.1(A) Q3.2(C) RL1.2(C2)
NetD8_1: D8.1(A) Q4.2(C) RL2.2(C2)
NetD9_1: D9.1(A) Q5.2(C) RL3.2(C2)
NetD10_1: D10.1(A) Q6.2(C) RL4.2(C2)
NetJ2_3: J2.3 ; port PC8
NetJ2_4: J2.4 ; port PC7
NetJ2_5: J2.5 ; port PC6
NetJ2_6: J2.6 ; port PB15
NetJ2_7: J2.7 ; port PB13
NetP2_1: P2.1 RL1.4(NO)
NetP3_1: P3.1 RL2.4(NO)
NetP4_1: P4.1 RL3.4(NO)
NetP5_1: P5.1 RL4.4(NO)
NetQ3_3: Q3.3(B) R19.2
NetQ4_3: Q4.3(B) R21.2
NetQ5_3: Q5.3(B) R23.2
NetQ6_3: Q6.3(B) R25.2
NetR18_2: R18.2 U7.1
NetR19_1: R19.1 U7.3
NetR20_2: R20.2 U8.1
NetR21_1: R21.1 U8.3
NetR22_2: R22.2 U9.1
NetR23_1: R23.1 U9.3
NetR24_2: R24.2 U10.1
NetR25_1: R25.1 U10.3
NetU3_20: U7.2 ; port PA4
NetU3_21: U8.2 ; port PA5
NetU3_22: U9.2 ; port PA6
NetU3_23: U10.2 ; port PA7

### Library data of the parts
D7-D10 = D Schottky: Schottky Diode; Published: 8-Jun-2000; LatestRevisionDate: 17-Jul-2002; LatestRevisionNote: Re-released for DXP Platform.; PackageReference: SMB; Publisher: Altium Limited; PackageDescription: DO-214-AA/SMB; 2 C-Bend Leads; Body 5.3 x 3.6 mm, inc. leads (LxW); Code_JEDEC: DO-214-AA
J2 = 61300811121: No Description Available; Mfr_Name: Wurth Electronics; Type: Headers, Male Pins; RefDes: RefDes
P2-P6 = 691322310002: WR-TBL Series 322 Horizontal PCB Header, THT, pitch 3.81mm, 2p; Manufacturer: Wurth Elektronik; Modularity: No; Rated Current: 10A; Working Voltage: 300V; Supply 3 Name: ThegioiIC; ComponentLink1Description: Website Link; ComponentLink1URL: https://www.we-online.com/redexpert/article/691322310002?ad; ComponentLink2Description: Datasheet Link; ComponentLink2URL: https://www.we-online.com/redexpert/spec/691322310002?ad; Manufacturer Part Number: 691322310002; Category: Terminal Blocks; Match Code: WR-TBL; Mount: Through Hole; Operating Temperature Max: 105°C; Operating Temperature Min: -40°C; Packaging: Box; Application: Pluggable; Number of Pins: 2; Number of Rows: 1; Orientation: Horizontal; Pitch: 3.81mm; Supply 1 Name: *; Supply 1 SN: *; Supply 1 URL: *; Supply 2 Name: *; Supply 2 SN: *; Supply 2 URL: *; Supply 3 SN: *; Supply 3 URL 1: https://www.thegioiic.com/kf-3-81-2-r-terminal-block-plug-in-han-pcb-2-chan-cong-3-81mm-300v-10a; Supply 3 URL 2: https://www.thegioiic.com/ul-3-81-2-r-terminal-block-plug-in-han-pcb-2-chan-cong-3-81mm-300v-10a-ulo
Q3-Q6 = BC817: NPN Bipolar Transistor
R18 R20 R22 R24 = 0006032211: RES, 220 Ohm, size 0603, 1%; Resistance Tolerant: +/-1%; Rated Power: 1/4W; Supply 1 Name: Mouser; Supply 1 SN: 667-ERJ-UP3F2200V; Supply 2 Name: Digikey; Supply 2 SN: 10-ERJ-UP3F2200VTR-ND 10-ERJ-UP3F2200VCT-ND 10-ERJ-UP3F2200VDKR-ND; Resistance: 220; Size: 0603; Mounting Technology: SMT; ComponentLink1Description: Datasheet link; ComponentLink1URL: https://api.pim.na.industrial.panasonic.com/file_stream/main/fileversion/4484; ComponentLink2Description: Supply 1 URL; ComponentLink2URL: https://www.mouser.vn/ProductDetail/Panasonic/ERJ-UP3F2200V?qs=sGAEpiMZZMvdGkrng054twq3eZrCFN89E%252BhCXuCu3h8RslmTO1I28Q%3D%3D; ComponentLink3Description: Supply 2 URL; ComponentLink3URL: https://www.digikey.com/en/products/detail/panasonic-electronic-components/ERJ-UP3F2200V/12092129
R19 R21 R23 R25 = 0006032221: RES, 2.2k Ohm, size 0603, 1%; Resistance Tolerant: +/-1%; Rated Power: 1/4W; Supply 1 Name: Mouser; Supply 1 SN: 667-ERJ-UP3F2201V; Supply 2 Name: Digikey; Supply 2 SN: 10-ERJ-UP3F2201VTR-ND 10-ERJ-UP3F2201VCT-ND 10-ERJ-UP3F2201VDKR-ND; Supply 3 Name: thegioiic; Supply 3 SN: NA; Resistance: 2.2k; Size: 0603; Mounting Technology: SMT; ComponentLink1Description: Datasheet link; ComponentLink1URL: https://api.pim.na.industrial.panasonic.com/file_stream/main/fileversion/4484; ComponentLink2Description: Supply 1 URL; ComponentLink2URL: https://www.mouser.vn/ProductDetail/Panasonic/ERJ-UP3F2201V?qs=sGAEpiMZZMvdGkrng054twq3eZrCFN89KeaXYJ5LTWyJgfuuVVfZrw%3D%3D; ComponentLink3Description: Supply 2 URL; ComponentLink3URL: https://www.digikey.com/en/products/detail/panasonic-electronic-components/ERJ-UP3F2201V/12092708; ComponentLink4Description: Supply 3 URL; ComponentLink4URL: https://www.thegioiic.com/dien-tro-2-2-kohm-0603-1
RL1-RL4 = HF46F: SeriesHF46F 12V 1 Form A 1A Gold Plated SUBMINIATURE INTERMEDIATE POWER RELAY; MF: Hongfa; Package: None; Price: None; Value: *; SnapEDA_Link: https://www.snapeda.com/parts/HF46F/Hongfa/view-part/?ref=snap; MP: HF46F; Availability: Not in stock; Check_prices: https://www.snapeda.com/parts/HF46F/Hongfa/view-part/?ref=eda
U7-U10 = PC817X2NIPW: PC817 series, SMD, I_F (max) = 500mA, V_F (max) = 1.4V. / Breakdown voltage: BV_CE = 80V, BV_BE = 6V.
VR1 = 07D471K 470V

## Sheet Sheet1.SchDoc
size A; SheetNumber: 5; SheetTotal: 5
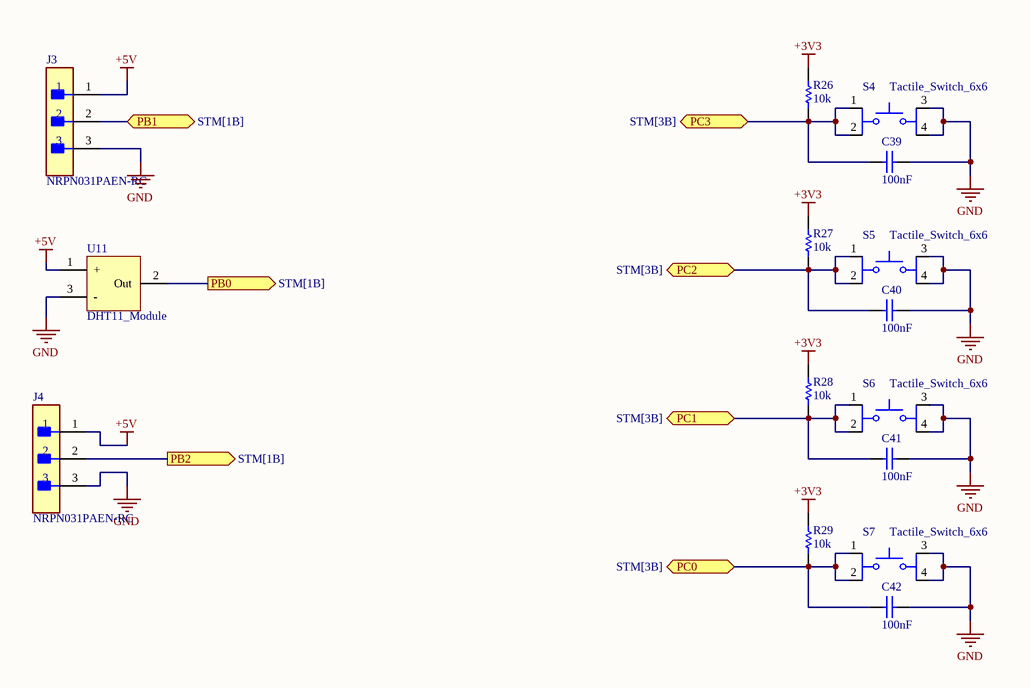
[diagram p4: Sheet1.SchDoc]

### Parts
C39  100nF  [CAP_0603]
C40  100nF  [CAP_0603]
C41  100nF  [CAP_0603]
C42  100nF  [CAP_0603]
J3  NRPN031PAEN-RC  [FP-NRPN031PAEN-RC-MFG]
J4  NRPN031PAEN-RC  [FP-NRPN031PAEN-RC-MFG]
R26  10k  [resistor_0603]
R27  10k  [resistor_0603]
R28  10k  [resistor_0603]
R29  10k  [resistor_0603]
S4  Tactile_Switch_6x6  [Tactile_Switch_6x6]
S5  Tactile_Switch_6x6  [Tactile_Switch_6x6]
S6  Tactile_Switch_6x6  [Tactile_Switch_6x6]
S7  Tactile_Switch_6x6  [Tactile_Switch_6x6]
U11  DHT11_Module  [DHT11_Module]

### Ports
PB0 (out, see STM[1B]), PB1 (bidir, see STM[1B]), PB2 (out, see STM[1B]), PC0 (bidir, see STM[3B]), PC1 (bidir, see STM[3B]), PC2 (bidir, see STM[3B]), PC3 (bidir, see STM[3B])

### Nets
+3V3: R26.1 R27.1 R28.1 R29.1
+5V: J3.1 J4.1 U11.1(+)
GND: C39.2 C40.2 C41.2 C42.2 J3.3 J4.3 S4.3 S4.4 S5.3 S5.4 S6.3 S6.4 S7.3 S7.4 U11.3(-)
NetC39_1: C39.1 R26.2 S4.1 S4.2 ; port PC3
NetC40_1: C40.1 R27.2 S5.1 S5.2 ; port PC2
NetC41_1: C41.1 R28.2 S6.1 S6.2 ; port PC1
NetC42_1: C42.1 R29.2 S7.1 S7.2 ; port PC0
NetJ3_2: J3.2 ; port PB1
NetJ4_2: J4.2 ; port PB2
NetU3_26: U11.2(Out) ; port PB0

### Library data of the parts
C39-C42 = 01060310410: as C3 on sheet Power_Circuit; ComponentLink1Description: Manufacturer; ComponentLink1URL: http://www.we-online.de; ComponentLink2Description: Datasheet; ComponentLink2URL: https://www.we-online.com/catalog/datasheet/885012206095.pdf; Operating Temperature: -55 to +125degC; Packaging: Tape and Reel; Supply 1 URL: https://www.we-online.com/en/components/products/WCAP-CSGP-50VDC?sq=885012206095R#885012206095R; Supply 2 SN: *; Supply 2 URL: https://www.thegioiic.com/tu-gom-0603-100nf-0-1uf-50v; Dissipation Factor: *; Height: *; Mounting Technology: SMT; Size: 0603; Capacitance: 100nF; Technical Reference: *
J3 J4 = CMP-002-00073-1: Male, 3 C, Straight, .079"CC; 3.60mm Head/2.80mm Tail, No Mt; Nylon 6-T, Brass, 105 C; Connector Type: Header; Voltage Rating: 150V; Max Operating Temperature: 105°C; Min Operating Temperature: -40°C; RoHS Compliant: Yes; Mounting Technology: Through Hole
R26-R29 = 0006031031: as R9 on sheet STM; Resistance: 10k; Size: 0603; Mounting Technology: SMT; ComponentLink1Description: Datasheet link; ComponentLink1URL: https://fscdn.rohm.com/en/products/databook/datasheet/passive/resistor/chip_resistor/esr-e.pdf; ComponentLink2Description: Supply 1 URL; ComponentLink2URL: https://www.mouser.vn/ProductDetail/ROHM-Semiconductor/ESR03EZPF1002?qs=sGAEpiMZZMvdGkrng054t67Efho1F8r6CDeAsqwFse8%3D; ComponentLink3Description: Supply 2 URL; ComponentLink3URL: https://www.digikey.com/en/products/detail/rohm-semiconductor/ESR03EZPF1002/1983429
S4-S7 = Tactile_Switch_6x6: Tactile Switch, 6x6mm
U11 = DHT11_Module: Temperature & Humidity Sensor, 3.3V-5V, 5mA

## Nets that join several sheets
+3V3: Power_Circuit (6 pins), STM (20 pins), ESP (7 pins), Output (R18.1 R20.1 R22.1 R24.1), Sheet1 (R26.1 R27.1 R28.1 R29.1)
+5V: Power_Circuit (9 pins), ESP (C33.2 C34.2 D6.2 U4.16), Output (J2.1 J2.8), Sheet1 (J3.1 J4.1 U11.1)
+12V: Power_Circuit (9 pins), Output (12 pins)
GND: Power_Circuit (24 pins), STM (27 pins), ESP (22 pins), Output (5 pins), Sheet1 (15 pins)
NetC39_1: STM (U3.11), Sheet1 (C39.1 R26.2 S4.1 S4.2)
NetC40_1: STM (U3.10), Sheet1 (C40.1 R27.2 S5.1 S5.2)
NetC41_1: STM (U3.9), Sheet1 (C41.1 R28.2 S6.1 S6.2)
NetC42_1: STM (U3.8), Sheet1 (C42.1 R29.2 S7.1 S7.2)
NetJ2_3: STM (U3.39), Output (J2.3)
NetJ2_4: STM (U3.38), Output (J2.4)
NetJ2_5: STM (U3.37), Output (J2.5)
NetJ2_6: STM (U3.36), Output (J2.6)
NetJ2_7: STM (U3.34), Output (J2.7)
NetJ3_2: STM (U3.28), Sheet1 (J3.2)
NetJ4_2: STM (U3.27), Sheet1 (J4.2)
NetU3_16: STM (U3.16), ESP (U6.27)
NetU3_17: STM (U3.17), ESP (U6.28)
NetU3_20: STM (U3.20), Output (U7.2)
NetU3_21: STM (U3.21), Output (U8.2)
NetU3_22: STM (U3.22), Output (U9.2)
NetU3_23: STM (U3.23), Output (U10.2)
NetU3_26: STM (U3.26), Sheet1 (U11.2)
OTA_RX: STM (U3.43), ESP (R12.2)
OTA_TX: STM (U3.42), ESP (R13.2)